# EAGLE design stm32f0_i2s (EAGLE 7.5.0)
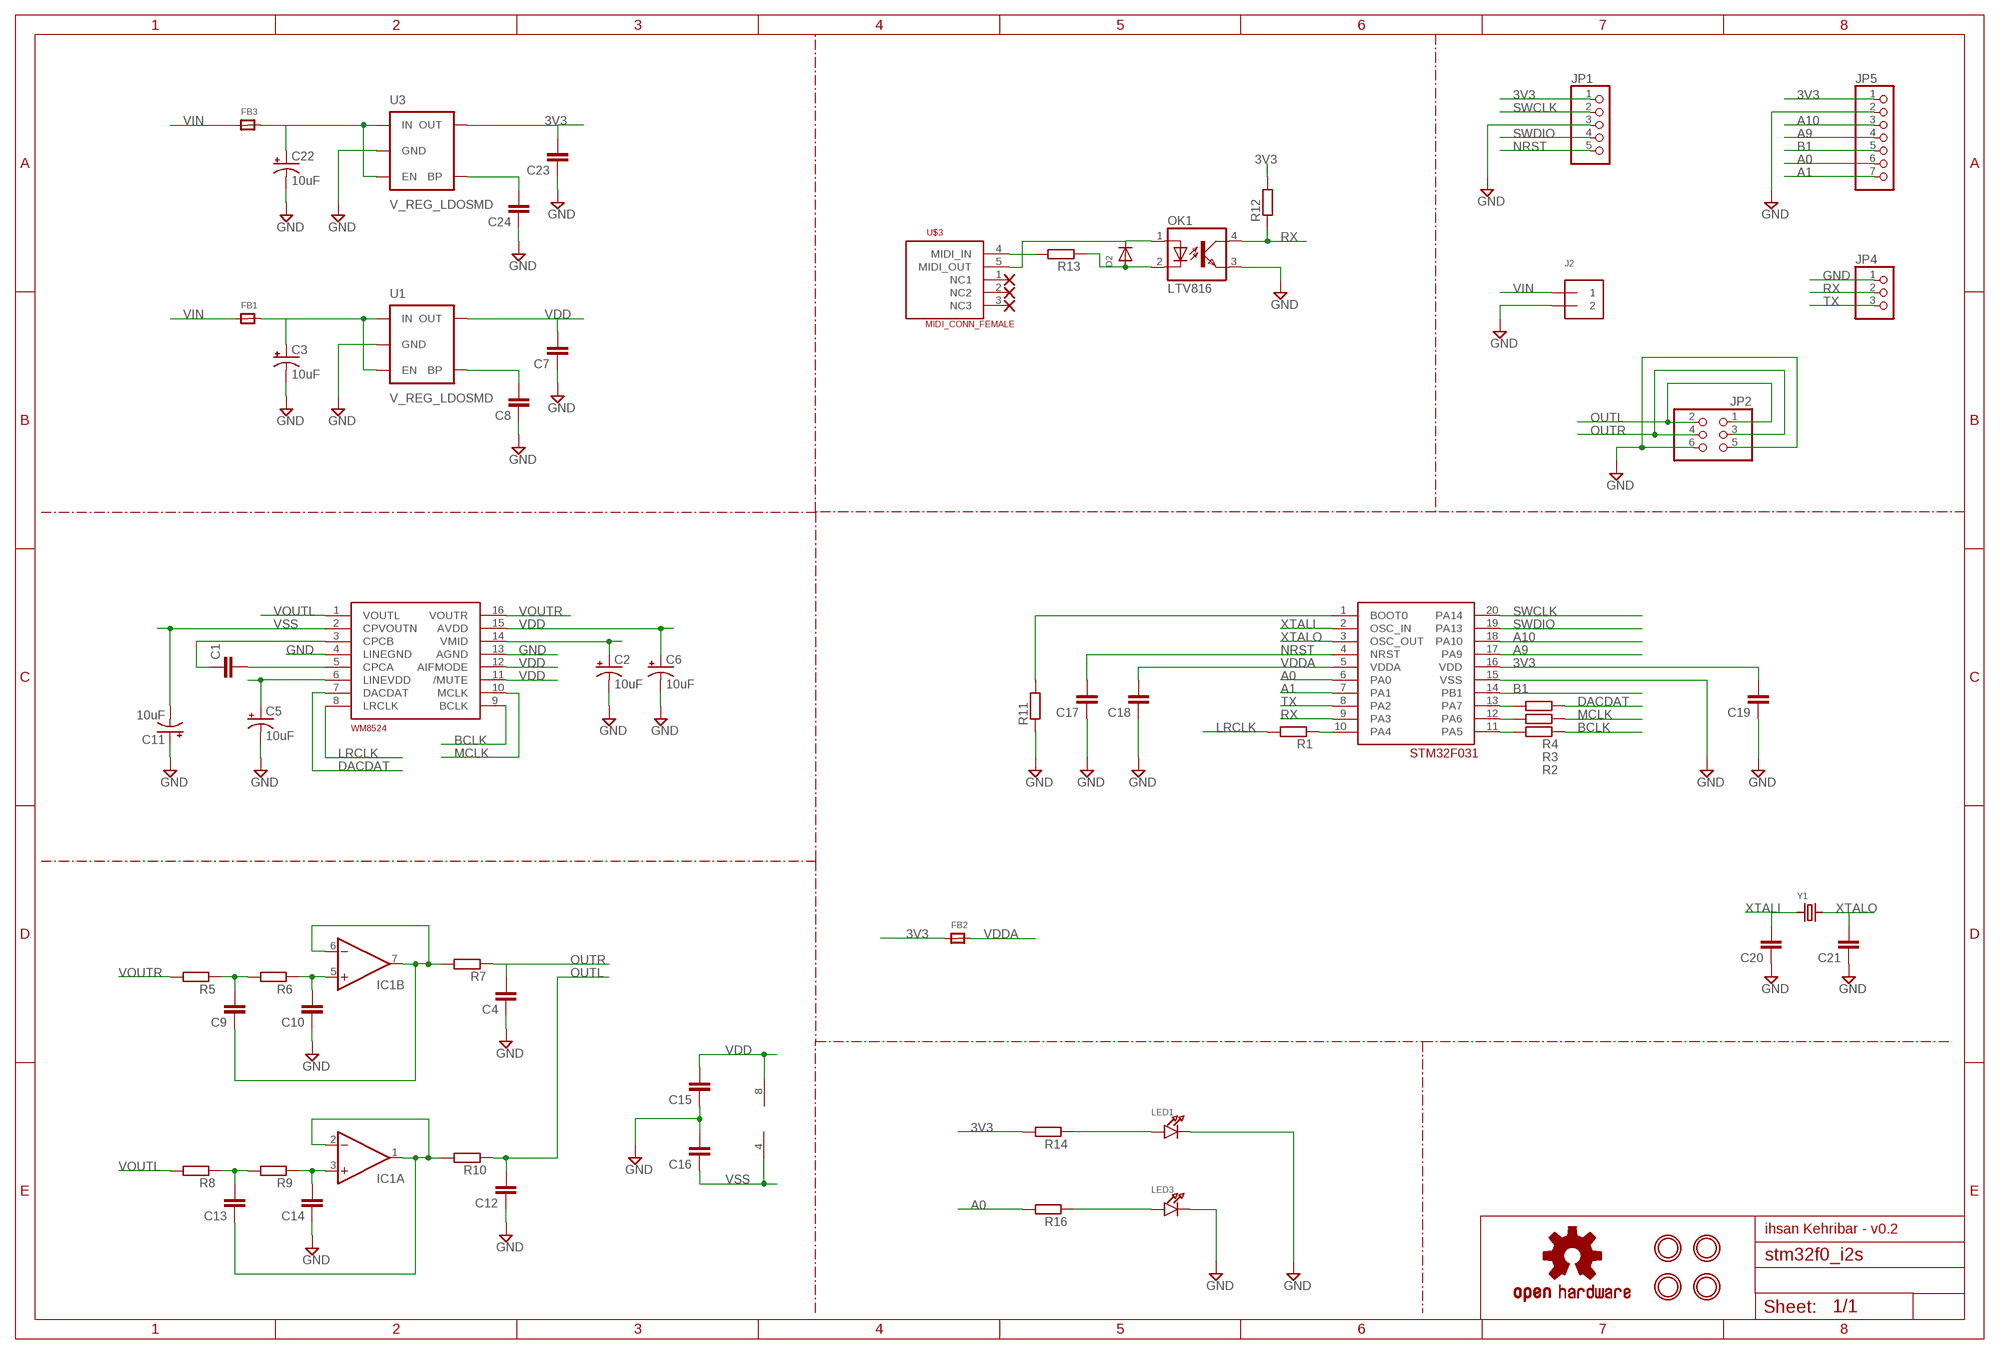
[diagram p0: schematic, sheet 1]

## Parts
C1  C-EUC0805  [C0805]
C2  10uF  10UF-TANT  [EIA3216]
C3  10uF  10UF-TANT  [EIA3216]
C4  C-EUC0805  [C0805]
C5  10uF  10UF-TANT  [EIA3216]
C6  10uF  10UF-TANT  [EIA3216]
C7  C-EUC0805  [C0805]
C8  C-EUC0805  [C0805]
C9  C-EUC0805  [C0805]
C10  C-EUC0805  [C0805]
C11  10uF  10UF-TANT  [EIA3216]
C12  C-EUC0805  [C0805]
C13  C-EUC0805  [C0805]
C14  C-EUC0805  [C0805]
C15  C-EUC0805  [C0805]
C16  C-EUC0805  [C0805]
C17  C-EUC0805  [C0805]
C18  C-EUC0805  [C0805]
C19  C-EUC0805  [C0805]
C20  C-EUC0805  [C0805]
C21  C-EUC0805  [C0805]
C22  10uF  10UF-TANT  [EIA3216]
C23  C-EUC0805  [C0805]
C24  C-EUC0805  [C0805]
D2  DIODEDO-1N4148  [DO-1N4148]
FB1  FERRITE0805  [0805]
FB2  FERRITE0805  [0805]
FB3  FERRITE0805  [0805]
IC1  TL082D  [SO08]
J2  TERMBLOCK_1X2  [TERMBLOCK_1X2-3.5MM]
JP1  HEADER-1X5ROUND  [1X05_ROUND]
JP2  PINHD-2X3  [2X03]
JP4  HEADER-1X3ROUND  [1X03_ROUND]
JP5  HEADER-1X7ROUND  [1X07_ROUND]
LED1  LED1206  [CHIPLED_1206]
LED3  LED1206  [CHIPLED_1206]
LOGO1  OSHW-LOGOM  [OSHW-LOGO-M]
OK1  LTV816  [DIL04]
R1  R-EU_R0805  [R0805]
R2  R-EU_R0805  [R0805]
R3  R-EU_R0805  [R0805]
R4  R-EU_R0805  [R0805]
R5  R-EU_R0805  [R0805]
R6  R-EU_R0805  [R0805]
R7  R-EU_R0805  [R0805]
R8  R-EU_R0805  [R0805]
R9  R-EU_R0805  [R0805]
R10  R-EU_R0805  [R0805]
R11  R-EU_R0805  [R0805]
R12  R-EU_R0805  [R0805]
R13  R-EU_R0805  [R0805]
R14  R-EU_R0805  [R0805]
R16  R-EU_R0805  [R0805]
U1  V_REG_LDOSMD  [SOT23-5]
U3  V_REG_LDOSMD  [SOT23-5]
U$1  IHSAN_WM8524  [TSSOP16]
U$2  IHSAN_STM32F031  [TSSOP20]
U$3  MIDI_CONN_FEMALE  [DIN_5_FEMALE]
U$4  MOUNTINGHOLE3.0THIN  [MOUNTINGHOLE_3.0_PLATEDTHIN]
U$5  MOUNTINGHOLE3.0THIN  [MOUNTINGHOLE_3.0_PLATEDTHIN]
U$6  MOUNTINGHOLE3.0THIN  [MOUNTINGHOLE_3.0_PLATEDTHIN]
U$7  MOUNTINGHOLE3.0THIN  [MOUNTINGHOLE_3.0_PLATEDTHIN]
Y1  CRYSTALTHIN32K  [CRYSTAL_4.9X1.8]

## Nets
3V3: C19.2 C23.2 FB2.1 JP1.1 JP5.1 R12.2 R14.2 U3.5(OUT) U$2.16(VDD)
A0: JP5.6 R16.2 U$2.6(PA0)
A1: JP5.7 U$2.7(PA1)
A9: JP5.4 U$2.17(PA9)
A10: JP5.3 U$2.18(PA10)
B1: JP5.5 U$2.14(PB1)
BCLK: R2.1 U$1.9(BCLK)
DACDAT: R4.1 U$1.7(DACDAT)
GND: C2.C(-) C3.C(-) C4.1 C5.C(-) C6.C(-) C7.1 C8.1 C10.1 C11.A(+) C12.1 C14.1 C15.1 C16.2 C17.1 C18.1 C19.1 C20.1 C21.1 C22.C(-) C23.1 C24.1 J2.2 JP1.3 JP2.5 JP2.6 JP4.1 JP5.2 LED1.C LED3.C OK1.3(EMIT) R11.1 U1.2(GND) U3.2(GND) U$1.4(LINEGND) U$1.13(AGND) U$2.15(VSS)
LRCLK: R1.2 U$1.8(LRCLK)
MCLK: R3.1 U$1.10(MCLK)
N$1: C1.1 U$1.3(CPCB)
N$2: C1.2 U$1.5(CPCA)
N$3: C2.A(+) U$1.14(VMID)
N$4: C5.A(+) U$1.6(LINEVDD)
N$5: C22.A(+) FB3.2 U3.1(IN) U3.3(EN)
N$6: R1.1 U$2.10(PA4)
N$7: R2.2 U$2.11(PA5)
N$8: R3.2 U$2.12(PA6)
N$9: R4.2 U$2.13(PA7)
N$10: C9.2 R5.1 R6.2
N$11: C10.2 IC1.5(B:+IN) R6.1
N$12: C3.A(+) FB1.2 U1.1(IN) U1.3(EN)
N$13: C8.2 U1.4(BP)
N$14: C9.1 IC1.6(B:-IN) IC1.7(B:OUT) R7.2
N$15: D2.C OK1.1(A) U$3.5(MIDI_OUT)
N$16: C13.2 R8.1 R9.2
N$17: C14.2 IC1.3(A:+IN) R9.1
N$18: C13.1 IC1.1(A:OUT) IC1.2(A:-IN) R10.2
N$19: D2.A OK1.2(C) R13.1
N$20: R11.2 U$2.1(BOOT0)
N$21: C24.2 U3.4(BP)
N$22: R13.2 U$3.4(MIDI_IN)
N$24: LED3.A R16.1
N$26: LED1.A R14.1
NRST: C17.2 JP1.5 U$2.4(NRST)
OUTL: C12.2 JP2.1 JP2.2 R10.1
OUTR: C4.2 JP2.3 JP2.4 R7.1
RX: JP4.2 OK1.4(COL) R12.1 U$2.9(PA3)
SWCLK: JP1.2 U$2.20(PA14)
SWDIO: JP1.4 U$2.19(PA13)
TX: JP4.3 U$2.8(PA2)
VDD: C6.A(+) C7.2 C15.2 IC1.8(P:V+) U1.5(OUT) U$1.11(/MUTE) U$1.12(AIFMODE) U$1.15(AVDD)
VDDA: C18.2 FB2.2 U$2.5(VDDA)
VIN: FB1.1 FB3.1 J2.1
VOUTL: R8.2 U$1.1(VOUTL)
VOUTR: R5.2 U$1.16(VOUTR)
VSS: C11.C(-) C16.1 IC1.4(P:V-) U$1.2(CPVOUTN)
XTALI: C20.2 U$2.2(OSC_IN) Y1.1
XTALO: C21.2 U$2.3(OSC_OUT) Y1.2
Unconnected: U$3.1(NC1) U$3.2(NC2) U$3.3(NC3)

## Notes on the sheet
- ihsan Kehribar - v0.2

## Library data of the parts
C1 C4 C7-C10 C12-C21 C23 C24 = rcl:C-EU: CAPACITOR, European symbol
C2 C3 C5 C6 C11 C22 = SparkFun-Capacitors:10UF-TANT: 10uF Tantalum SMT CAP-00811- 16V 10% (EIA-3216); PROD_ID: CAP-00811
D2 = microbuilder:DIODE: Diode SMA Model Volts Amps Type Vf Vr Digikey # Notes SSA34-E3 40V 3A Schottky 480mV @ 3A 200uA @ 40V SSA34-E3/61TGITR-ND CDBA120-G 20V 1A Schottky 500mV @ 1A 500uA @ 20V 641-1014-6-ND REEL MBRA210 10V 2A Schottky 350mV @ 2A 700uA @ 10V MBRA210LT3 SOD-123 Model Volts Amps Type Vf Vr Order # Notes BAT54T1G 30V 200mA Schottky 800mV @ 200mA 2uA @ 25V BAT54T1GOSTR-ND B0530W 30V 500mA Schottky 430mV @ 500mA 130uA @ 30V B0530W-FDICT-ND REEL MBR120 1A 20V Schottky 340mV @ 1A MBR120VLSFT1GOSCT-ND SOD-323 Model Volts Amps Type Vf Vr Order # Notes PMEG2005EJ 20V 500mA Schottky 355mV @ 500mA 568-4110-1-ND ZLLS410 10V 570mA Schottky 380mV @ 570mA ZLLS410CT-ND 1N4148WS 75V 150mA Silicon/Simple 1V 1N4148WSFSCT-ND REEL SOD-523 Model Volts Amps Type Vf Vr Order # Notes BAT54XV2 30V 200mA Schottky 0.8V @ 100mA BAT54XV2CT-ND TB751S 30V 30mA Schottky RB751S-40TE61CT-ND SOT23-R/W (R = Solder Paste/Reflow Ovens, W = Hand-Soldering) Model Volts Amps Type Vf Vr Order # Notes BAT54FILM 40V 300mA Schottky 497-7162-1-ND
FB1-FB3 = microbuilder:FERRITE: Ferrite Bead 0603 MMZ1608B121C - 120 Ohm @ 100MHz, 600mA, 0.15 Ohm DC Resistance - Digikey: 445-2164-1-ND BK1608HW121-T - 120 Ohm, 600mA Ferrite Chip - Digikey: 587-1876-2-ND 0805 HZ0805B272R-10 - 2.7K Ohm @ 100MHz, 200mA, 0.8 Ohm DC Resistance - Digikey: 240-2504-1-ND (see also Murata BLM21BD272SN1L) MMZ2012Y152B - 1.5K Ohm @ 100MHz, 500mA, 0.4 Ohm DC Resistance - Digikey: 445-1560-1-ND - Mainly for high frequency (80-400MHz) MMZ2012R102A - 1K Ohm @ 100MHz, 500mA, 0.3 Ohm DC Resistance - Digikey: 445-1555-2-ND - More general purpose (10-200MHz)
IC1 = linear:TL082: OP AMP Data sheet <http://www.ti.com/lit/ds/symlink/tl084a . pdf>; DATA_SHEET: <a href="http://www.ti.com/lit/ds/symlink/tl084a.pdf"> Data sheet </a>
J2 = microbuilder:TERMBLOCK_1X2: 3.5mm Terminal block http://www.ladyada.net/library/pcb/eaglelibrary.html
JP1 = microbuilder:HEADER-1X5: PIN HEADER
JP2 = pinhead:PINHD-2X3: PIN HEADER
JP4 = microbuilder:HEADER-1X3: PIN HEADER
JP5 = microbuilder:HEADER-1X7: PIN HEADER
LED1 LED3 = microbuilder:LED: LED 0603 - 0603 Surface Mount Package 2mA: Green LED - Low Power (3.9mcd, 2ma, 1.7Vf) - Digikey: 475-2709-2-ND Orange LED - Low Power (9.8mcd, 2ma, 1.8Vf) - Digikey: 475-1194-2-ND Red LED - Low Power (5mcd, 2ma, 1.8Vf) - Digikey: 475-1195-2-ND Yellow LED - Low Power (7mcd, 2ma, 1.8Vf) - Digikey: 475-1196-2-ND 5mA: Blue LED - Low Power (17mcd, 5ma, 2.9Vf) - Digikey: LNJ937W8CRACT-ND 0805 - 0805 Surface Mount Package 2mA: Red LED (8.8mcd, 2mA, 1.8Vf, Clear) - Low Power [Digikey: 475-2510-1-ND] Green LED (5mcd, 2mA, 1.8Vf, Clear) - Low Power [Digikey: 475-2730-1-ND] Yellow LED (11.3mcd, 2mA, 1.8Vf, Clear) - Low Power [Digikey: 475-2555-1-ND] 20mA: Red LED (104mcd, 20mA, Diffused) - LS R976 [Digikey: 475-1278-6-ND] Red LED (12mcd, 20mA, 2.0Vf, Clear) - APT2012EC [Digikey: 754-1128-1-ND] Green LED (15mcd, 20mA, 2.2Vf, Clear) - APT2012GC [Digikey: 754-1131-1-ND] Orange LED (160mcd, 20mA, 2.1Vf, Clear) - APT2012SECK [Digikey: 754-1130-1-ND] 1206 - 1206 Surface Mount Package Green LED (26mcd, 20mA, Diffused) - LG N971 [Digikey: 475-1407-6-ND] Red LED (15mcd, 20mA, Diffused) - LH N974 [Digikey: 475-1416-6-ND]
LOGO1 = SparkFun-Aesthetics:OSHW-LOGO: Open Source Hardware Logo This logo indicates the piece of hardware it is found on incorporates a OSHW license and/or adheres to the definition of open source hardware found here: http://freedomdefined.org/OSHW
OK1 = optocoupler:LTV816: OPTO COUPLER Source: LITEON, LTV816.pdf; OC_FARNELL: unknown; OC_NEWARK: unknown
R1-R14 R16 = rcl:R-EU_: RESISTOR, European symbol
U1 U3 = SparkFun-PowerIC:V_REG_LDO: Voltage Regulator LDO Standard 150mA LDO voltage regulator in SOT-23 layout. Micrel part MIC5205. BP (by-pass) pin is used to lower output noise with 470pF cap.
U$1 = SparkFun-DigitalIC_ihsan:IHSAN_WM8524
U$2 = SparkFun-DigitalIC_ihsan:IHSAN_STM32F031
U$3 = SparkFun-Connectors:MIDI_CONN_FEMALE: MIDI connector, no strain relieve (DIN-5 female)
U$4-U$7 = microbuilder:MOUNTINGHOLE: Mounting Hole For #2 screws (0.086"/2.18mm width, 0.094"/2.4mm hole) use 2.5mm
Y1 = microbuilder:CRYSTAL: Crystals HC49UP - Surface Mount Crystal 4.0MHz 18pF +/-30ppm Surface Mount Crystal [Digikey: 535-9857-1-ND] 12.0 MHz Surface Mount Crystal [Digikey: 535-9869-6-ND] 25.0 MHz Surface Mount Crystal [Digikey: 535-9078-1-ND] 2.5 x 2.0mm - MEMs SMT Crystal 16.0 MHz 10pF 20ppm 2.5 x 2.0mm Crystal [Digikey -40-85°C: 535-10923-1-ND] 3.2 x 2.5mm - MEMs SMT Crystal 12.0 MHz 8pF 15ppm 3.2 x 2.5mm Crystal [Digikey: -10-70°C: 644-1047-1-ND -40-125°C: 644-1128-1-ND] 16.0 MHz 8pF 15ppm 3.2 x 2.5mm Crystal [Digikey: -10-70°C: 644-1049-1-ND -40-125°C: 644-1129-2-ND] 16.0 MHz 10pF 10ppm 3.2 x 2.5mm Crystal [Digikey: 644-1100-1-ND] 27.12 MHz 18pF 30ppm 3.2 x 2.5mm Crystal [Digikey: 887-1424-1-ND] 27.12MHz 10pF 10ppm 3.2 x 2.5mm Crystal [Digikey: 887-1329-1-ND] 4.9 x 1.8mm - MEMs SMT Crystal 32.768 KHz 12.5pF 20ppm 4.9 x 1.8mm Crystal [Digikey: SE2415CT-ND] 8.0 x 3.8mm - Surface Mount Crystal 32.768kHz 12.5pF 20ppm -40°C-85°C [Digikey: 535-9166-2-ND] Cylinder 32.768KHz Cylinder Crystal (2x6mm body) [Ex. Digikey: 300-8341-2-ND]

## Board
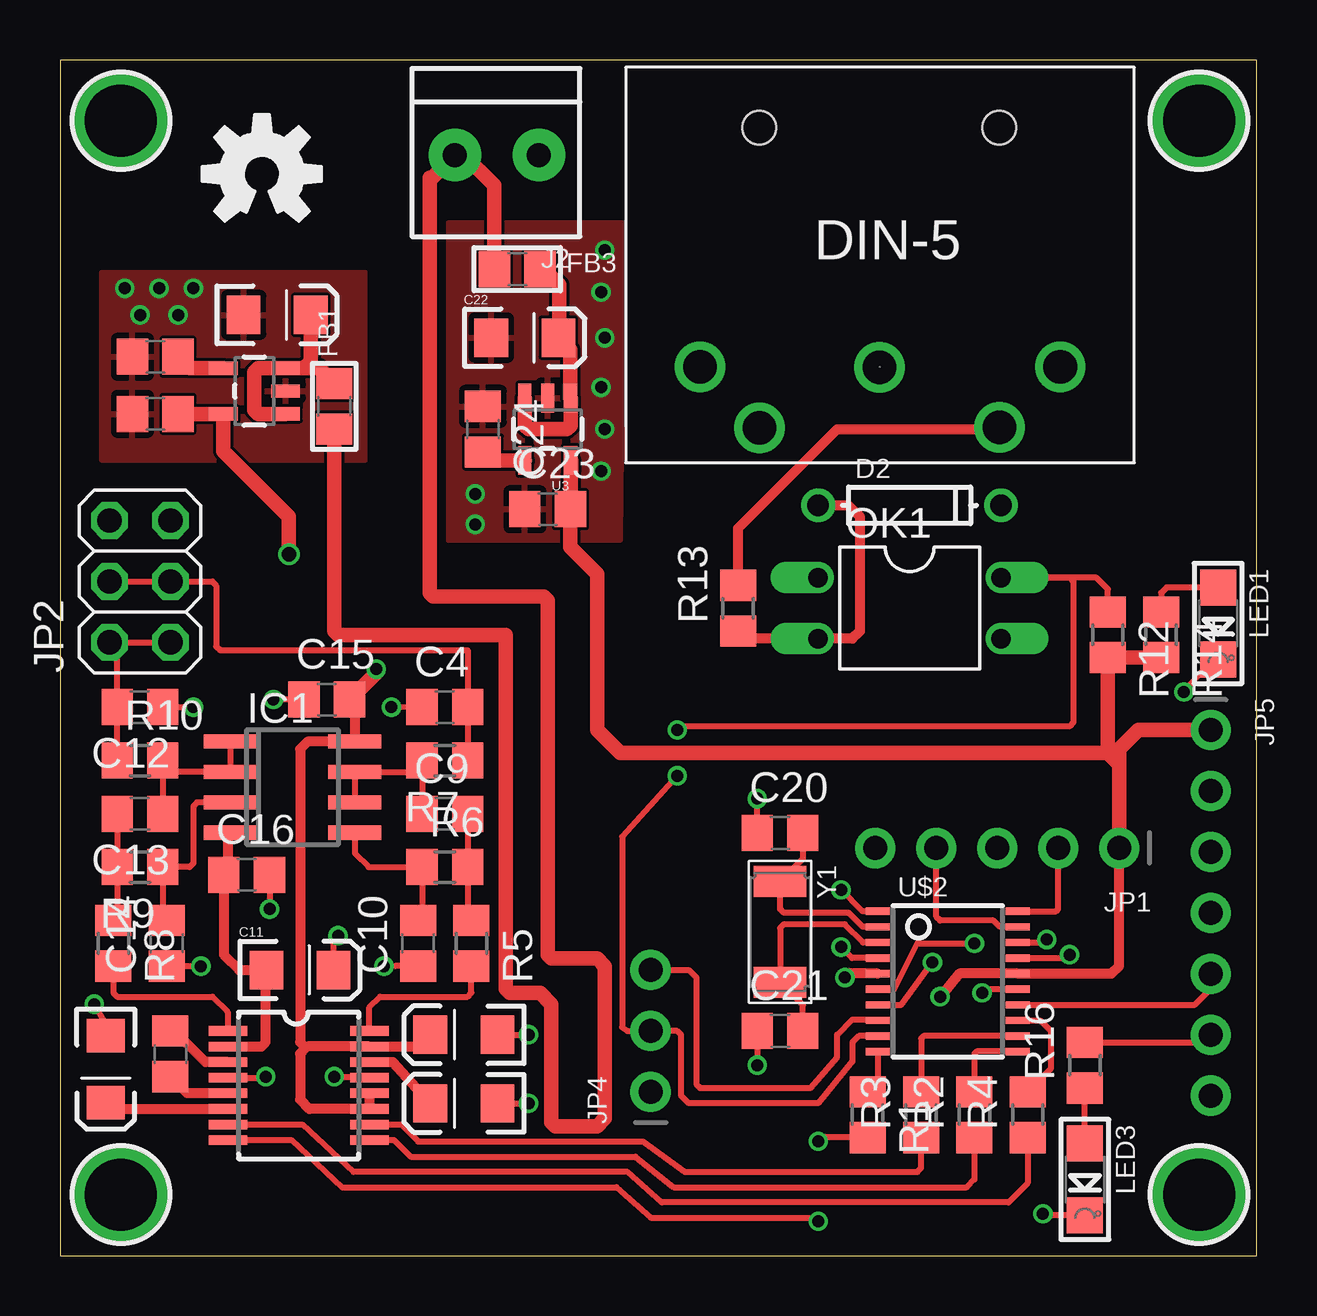
[diagram p1: board, top side]
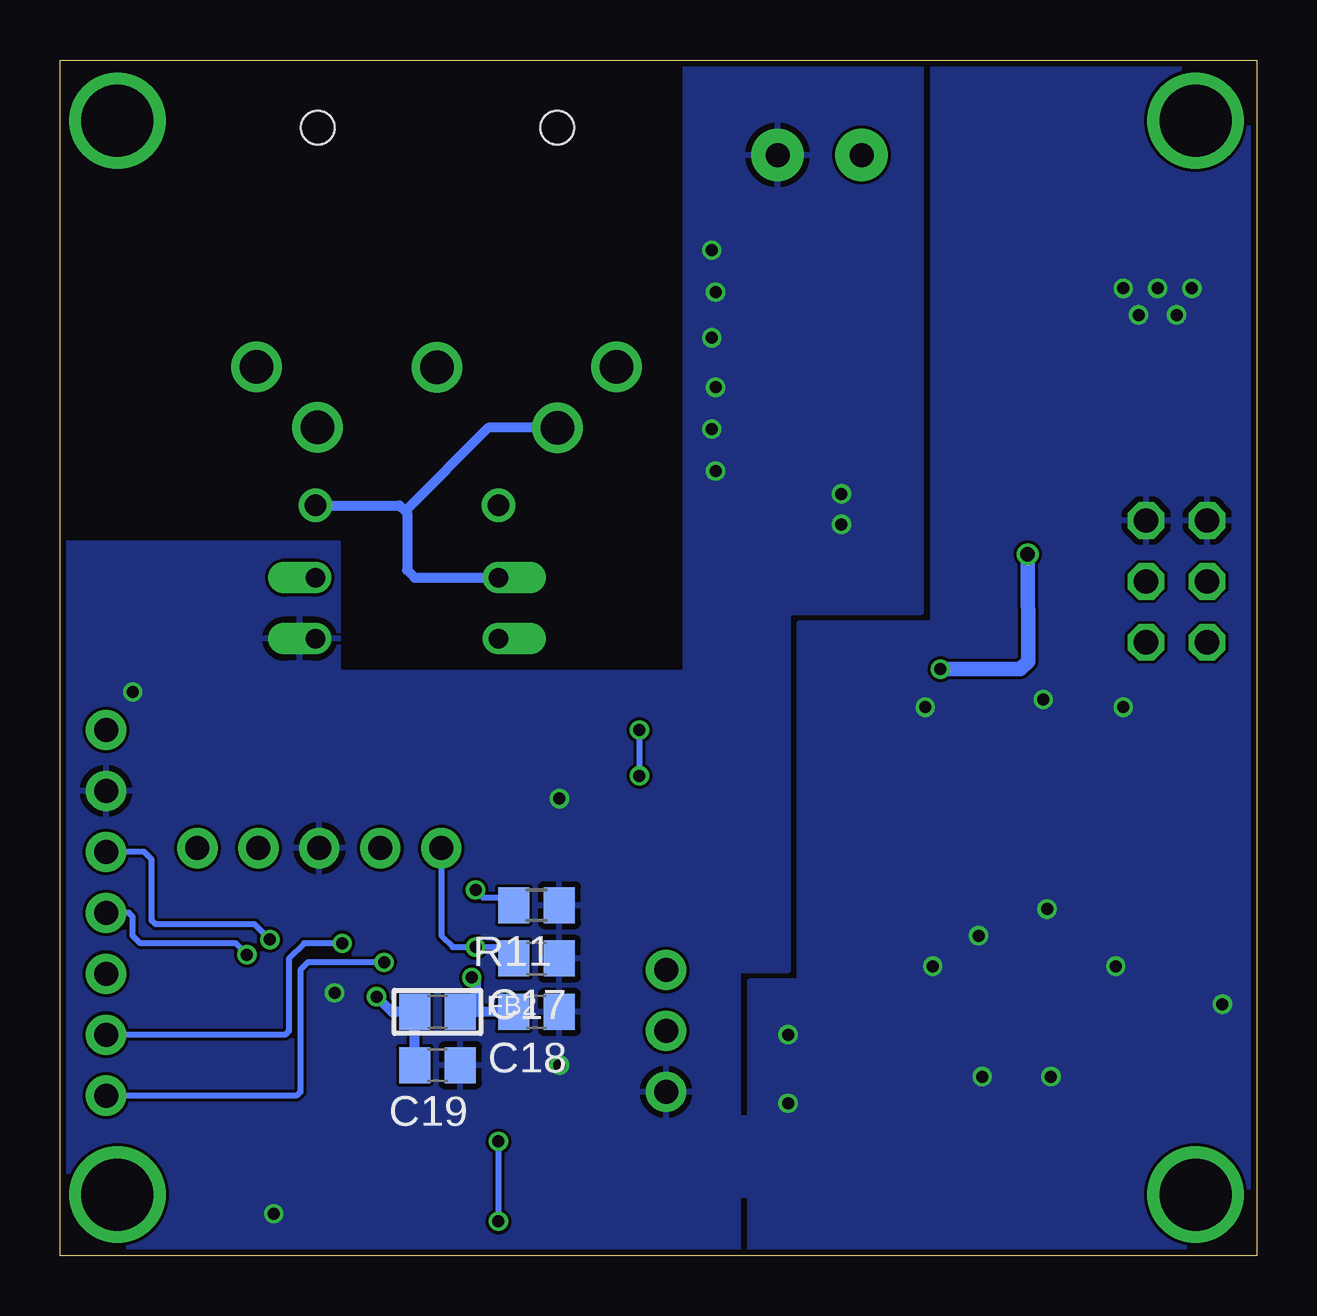
[diagram p2: board, bottom side, seen from below]

Size 49.86 x 49.84 mm. Coordinates in mm from the lower left corner, seen from the top.
Outline: 0,0 49.86,0 49.86,49.84 0,49.84 0,0
Copper layers (1*16): Top 0.035mm / dielectric 1.5mm / Bottom 0.035mm
Design rules "dirt_cheap_dirty_boards.v1": minimum track width 5mil, minimum drill 12mil, track to track 5mil, track to pad 5mil, pad to pad 5mil, via to via 5mil, smd to smd 0mil, copper to edge 10mil, drill to drill 10mil, minimum pad ring 10mil, minimum via ring 6mil, stop-mask expansion 2mil, vias tented up to drill 25mil, thermal gap 10mil

### Footprints (pad centres in the part's own frame; a part is rotated, then mirrored left to right if it is on the bottom)
C0805 = smd 1.3 x 1.5: 1 -0.95,0; 2 0.95,0
EIA3216 = smd 1.4 x 1.6: A 1.4,0; C -1.4,0
DO-1N4148 = drill 0.9: A -3.81,0; C 3.81,0
0805 = smd 1.3 x 1.5: 1 -0.95,0; 2 0.95,0
SO08 = smd 0.6 x 2.2: 1 -1.905,-2.6; 2 -0.635,-2.6; 3 0.635,-2.6; 4 1.905,-2.6; 5 1.905,2.6; 6 0.635,2.6; 7 -0.635,2.6; 8 -1.905,2.6
TERMBLOCK_1X2-3.5MM = drill 1 pad 2.184: 1 1.8,0; 2 -1.7,0
1X05_ROUND = drill 1 pad 1.676: 1 -5.08,0; 2 -2.54,0; 3 0,0; 4 2.54,0; 5 5.08,0
2X03 = drill 1.016 octagon: 1 -2.54,-1.27; 2 -2.54,1.27; 3 0,-1.27; 4 0,1.27; 5 2.54,-1.27; 6 2.54,1.27
1X03_ROUND = drill 1 pad 1.676: 1 -2.54,0; 2 0,0; 3 2.54,0
1X07_ROUND = drill 1 pad 1.676: 1 -7.62,0; 2 -5.08,0; 3 -2.54,0; 4 0,0; 5 2.54,0; 6 5.08,0; 7 7.62,0
CHIPLED_1206 = smd 1.5 x 1.5: A 0,-1.496; C 0,1.496
DIL04 = drill 0.813 offset: 1 -1.27,-3.81; 2 1.27,-3.81; 3 1.27,3.81; 4 -1.27,3.81
R0805 = smd 1.3 x 1.5: 1 -0.95,0; 2 0.95,0
SOT23-5 = smd 0.55 x 1.2: 1 -0.95,-1.3; 2 0,-1.3; 3 0.95,-1.3; 4 0.95,1.3; 5 -0.95,1.3
TSSOP16 = smd 0.4 x 1.6: 1 -2.225,-2.85; 2 -1.575,-2.85; 3 -0.925,-2.85; 4 -0.275,-2.85; 5 0.375,-2.85; 6 1.025,-2.85; 7 1.675,-2.85; 8 2.325,-2.85; 9 2.325,3.05; 10 1.675,3.05; 11 1.025,3.05; 12 0.375,3.05; 13 -0.275,3.05; 14 -0.925,3.05; 15 -1.575,3.05; 16 -2.225,3.05
TSSOP20 = smd 0.305 x 0.991: 1 -2.925,-2.918; 2 -2.275,-2.918; 3 -1.625,-2.918; 4 -0.975,-2.918; 5 -0.325,-2.918; 6 0.325,-2.918; 7 0.975,-2.918; 8 1.625,-2.918; 9 2.275,-2.918; 10 2.925,-2.918; 11 2.925,2.918; 12 2.275,2.918; 13 1.625,2.918; 14 0.975,2.918; 15 0.325,2.918; 16 -0.325,2.918; 17 -0.975,2.918; 18 -1.625,2.918; 19 -2.275,2.918; 20 -2.925,2.918
DIN_5_FEMALE = drill 1.4: 1 0.46,3.61; 2 -7.07,3.6; 3 7.94,3.6; 4 -4.53,6.12; 5 5.47,6.13 | hole 1.4: -4.52,-6.38; 5.47,-6.38
MOUNTINGHOLE_3.0_PLATEDTHIN = drill 3 pad 3.6: P$1 0,0
CRYSTAL_4.9X1.8 = smd 1.3 x 2.2: 1 -2.1,0; 2 2.1,0

### Placement (x,y rotation side)
C1  4.6,8.41 270 top
C2  16.83,6.35 180 top
C3  9.05,39.21 0 top
C4  16.03,22.86 0 top
C5  1.91,7.78 270 top
C6  16.83,9.21 180 top
C7  3.97,35.08 0 top
C8  3.97,37.47 0 top
C9  16.03,18.41 0 top
C10  14.92,13.02 90 top
C11  10,11.91 0 top
C12  3.33,22.86 180 top
C13  3.33,18.41 180 top
C14  4.45,13.02 90 top
C15  11.11,23.18 0 top
C16  7.78,15.88 0 top
C17  30,12.38 180 bottom
C18  30,10.16 180 bottom
C19  34.13,7.94 180 bottom
C20  30,17.62 0 top
C21  30,9.37 0 top
C22  19.37,38.26 0 top
C23  20.32,31.11 0 top
C24  17.62,34.45 270 top
D2  35.4,31.27 0 top
FB1  11.43,35.4 90 top
FB2  34.13,10.16 0 bottom
FB3  19.05,41.12 0 top
IC1  9.68,19.53 270 top
J2  18.26,45.88 180 top
JP1  39.05,16.99 180 top
JP2  3.33,28.1 90 top
JP4  24.61,9.37 90 top
JP5  47.94,14.29 270 top
LED1  48.26,26.35 180 top
LED3  42.7,3.17 180 top
LOGO1  8.41,45.09 0 top
OK1  35.4,26.99 270 top
R1  33.66,5.87 270 top
R2  38.1,5.87 90 top
R3  35.88,5.87 90 top
R4  40.32,5.87 90 top
R5  17.14,13.02 270 top
R6  16.03,16.19 0 top
R7  16.03,20.64 180 top
R8  2.22,13.02 270 top
R9  3.33,16.19 180 top
R10  3.33,20.64 0 top
R11  30,14.61 180 bottom
R12  43.66,25.88 270 top
R13  28.26,26.99 90 top
R14  45.88,25.88 270 top
R16  42.7,7.94 90 top
U1  8.1,36.04 90 top
U3  20.32,34.45 180 top
U$1  9.84,7.14 270 top
U$2  36.99,11.43 270 top
U$3  34.61,40.64 180 top
U$4  47.47,2.54 0 top
U$5  47.47,47.31 0 top
U$6  2.54,47.31 0 top
U$7  2.54,2.54 0 top
Y1  30,13.49 270 top

### Tracks (layer width: path | path; a pad name or v marks a point on that pad's centre or on a via)
3V3  (via drill 0.5)
  Top 0.254: U3.5 21.3,33.15
  Top 0.406: v36.67,10.79 37.47,11.76 U$2.16 43.82,11.76 44.13,12.06 JP1.1
  Top 0.61: 21.3,33.15 C23.2 21.27,29.53 22.38,28.42 22.38,21.91 23.34,20.95 43.66,20.95 44.13,20.48 | 44.13,21.11 43.97,20.95 43.66,21.27 R12.2 R14.2 | 44.13,21.11 44.13,20.48 | 44.13,20.48 JP1.1 | JP5.1 44.93,21.91 44.13,21.11
  Bottom 0.406: C19.2 FB2.1 36.04,10.16 v36.67,10.79
A0  (via drill 0.5)
  Top 0.254: U$2.6 34.76,11.11 35.72,13.02 v38.1,13.02 | R16.2 47.62,8.89 JP5.6
  Bottom 0.254: v38.1,13.02 39.69,13.02 40.32,12.38 40.32,9.37 40.48,9.21 JP5.6
A1  (via drill 0.5)
  Top 0.254: U$2.7 35.06,10.46 v36.35,12.22
  Bottom 0.254: v36.35,12.22 39.53,12.22 39.85,11.91 39.85,6.83 40.01,6.67 JP5.7
A9  (via drill 0.5)
  Top 0.254: U$2.17 41.93,12.4 v42.07,12.54
  Bottom 0.254: v42.07,12.54 42.55,13.02 46.51,13.02 46.83,13.34 46.83,14.13 46.99,14.29 JP5.4
A10  (via drill 0.5)
  Top 0.254: U$2.18 40.99,13.05 v41.12,13.18
  Bottom 0.254: v41.12,13.18 41.75,13.81 45.88,13.81 46.04,13.97 46.04,16.51 46.35,16.83 JP5.3
B1
  Top 0.254: U$2.14 47.28,10.46 47.94,11.11 JP5.5
BCLK
  Top 0.254: R2.1 38.1,3.17 37.78,2.86 25.56,2.86 23.97,4.13 14.61,4.13 13.91,4.82 U$1.9
DACDAT
  Top 0.254: R4.1 40.32,3.02 39.53,2.22 25.08,2.22 23.65,3.49 12.22,3.49 10.09,5.47 U$1.7
GND  (via drill 0.5)
  Top 0.254: C15.1 v8.89,23.18 | C4.1 13.97,22.86 v13.81,22.86 | C16.2 v8.73,14.45 | C10.1 13.97,12.07 v13.49,12.06 | U$1.4 8.53,7.42 v8.57,7.46 | v11.43,7.46 12.85,7.46 U$1.13 | C5.C 1.91,9.68 v1.43,10.48 | C14.1 5.71,12.07 v5.87,12.06 | C11.A 11.4,13.15 v11.59,13.34 | C12.1 v5.56,22.86 | C2.C v19.53,6.35 | C6.C v19.53,9.21 | U$2.15 38.57,11.11 v38.42,10.95 | C21.1 v29.05,7.94 | C20.1 v29.05,19.05 | LED1.C 48.03,24.86 v46.83,23.5 | LED3.C 41.02,1.68 v40.96,1.75
  other vias: 22.54,36.2 22.7,34.45 22.54,40.16 22.7,41.91 17.3,31.75 22.7,38.26 17.3,30.48 22.54,32.7 4.13,40.32 5.56,40.32 2.7,40.32 3.33,39.21 4.92,39.21
  pour Top: 16.19,43.02 16.19,29.84 23.34,29.84 23.5,43.02
  pour Bottom: 0,0 0,49.85 13.49,49.85 13.49,26.35 19.05,26.35 19.05,11.43 21.11,11.43 21.11,5.71 21.59,5.71 21.59,11.91 19.53,11.91 19.53,26.83 13.97,26.83 13.97,49.85 23.81,49.85 23.81,24.29 38.26,24.29 38.26,29.69 49.85,29.69 49.85,0 21.59,0 21.59,2.54 21.11,2.54 21.11,0
  pour Top: 1.75,40.96 1.75,33.18 12.7,33.18 12.7,40.96
LRCLK  (via drill 0.5)
  Top 0.254: v31.59,1.43 31.43,1.59 24.61,1.59 23.18,2.86 11.75,2.86 9.63,4.82 U$1.8 | R1.2 31.75,4.92 v31.59,4.76
  Bottom 0.254: v31.59,4.76 v31.59,1.43
MCLK
  Top 0.254: R3.1 35.88,3.65 35.72,3.49 26.04,3.49 24.29,4.76 14.92,4.76 14.22,5.47 U$1.10
N$1
  Top 0.406: C1.1 4.76,9.36 6.06,8.07 U$1.3
N$2
  Top 0.254: C1.2 4.76,7.46
  Top 0.406: U$1.5 5.3,6.77 C1.2
N$3
  Top 0.406: U$1.14 13.87,8.07 C2.A
N$4
  Top 0.254: 2.17,6.12 C5.A
  Top 0.406: 2.17,6.12 U$1.6
N$5
  Top 0.254: U3.1 | FB3.2 20.16,41.12 | 20.8,38.29 C22.A
  Top 0.61: U3.3 19.37,34.6 19.53,34.45 21.11,34.45 21.27,34.61 U3.1 | U3.1 21.27,37.76 C22.A | 20.16,41.12 20.8,40.48 20.8,38.29
N$6
  Top 0.254: U$2.10 34.07,7.24 R1.1
N$7
  Top 0.254: U$2.11 38.19,8.51 38.1,8.41 R2.2
N$8
  Top 0.254: U$2.12 35.98,9.15 35.88,9.05 R3.2
N$9
  Top 0.254: U$2.13 40.84,9.8 41.27,9.37 41.27,7.78 R4.2
N$10
  Top 0.254: C9.2 R6.2 16.98,14.13 R5.1 17.14,14.13
N$11
  Top 0.254: C10.2 15.08,14.13 R6.1 12.86,16.19 12.28,16.77 IC1.5
N$12
  Top 0.406: U1.1
  Top 0.61: U1.1 8.26,35.08 8.1,35.24 8.1,36.83 8.25,36.99 U1.3 10.16,36.99 | 10.16,36.99 10.79,36.99 FB1.2 | C3.A 10.45,37.27 10.16,36.99
N$13
  Top 0.406: 5.4,36.99 C8.2
  Top 0.61: U1.4 5.4,36.99
N$14
  Top 0.254: IC1.6 IC1.7 14.61,20.16 R7.2 C9.1
N$15
  Bottom 0.406: D2.C 35.72,31.27 35.48,31.04 | 35.48,31.04 35.4,30.96 35.4,28.57 35.08,28.26 OK1.1 | U$3.5 32.01,34.51 35.48,31.04
N$16
  Top 0.254: C13.2 R9.2 2.38,14.13 R8.1
N$17
  Top 0.254: IC1.3 5.71,18.89 5.56,18.73 5.56,16.35 5.4,16.19 R9.1 4.28,14.13 C14.2
N$18
  Top 0.254: IC1.1 IC1.2 4.76,20.16 R10.2 C13.1 4.6,18.1
N$19
  Top 0.406: R13.1 28.58,25.72 OK1.2 33.02,25.72 33.34,26.04 33.34,30.8 32.86,31.27 D2.A
N$20  (via drill 0.5)
  Top 0.254: v32.54,15.24 33.43,14.36 U$2.1
  Bottom 0.254: v32.54,15.24 32.23,14.92 31.27,14.92 R11.2
N$21
  Top 0.254: 17.97,33.15 C24.2
  Top 0.61: U3.4 17.97,33.15
N$22
  Top 0.406: R13.2 28.26,30.32 32.38,34.45 39.07,34.45 U$3.4
N$24
  Top 0.254: LED3.A R16.1
N$26
  Top 0.254: LED1.A 46.1,27.85 45.88,27.62 R14.1
NRST  (via drill 0.5)
  Top 0.254: v32.54,12.86 33,12.4 U$2.4
  Bottom 0.254: C17.2 31.11,12.7 31.27,12.86 v32.54,12.86 33.5,12.86 33.97,13.34 JP1.5
OUTL
  Top 0.254: JP2.1 JP2.2 2.38,25.24 C12.2 R10.1
OUTR
  Top 0.254: JP2.4 JP2.3 6.35,28.1 6.51,27.94 6.51,25.4 6.67,25.24 16.99,25.24 C4.2 R7.1
RX  (via drill 0.5)
  Top 0.254: R12.1 43.66,27.78 43.18,28.26 OK1.4 42.07,28.26 42.23,28.1 42.23,22.23 42.07,22.07 25.88,22.07 v25.72,21.91 | U$2.9 33.28,9.15 33.02,8.89 33.02,8.1 31.59,6.35 26.19,6.35 25.88,6.67 25.88,9.21 25.72,9.37 JP4.2 23.65,9.37 23.42,9.53 23.42,17.46 v25.72,20
  Bottom 0.254: v25.72,21.91 v25.72,20
SWCLK
  Top 0.254: U$2.20 41.5,14.36 41.59,14.45 JP1.2
SWDIO
  Top 0.254: U$2.19 39.16,13.71 38.89,13.97 36.67,13.97 36.51,14.13 JP1.4
TX
  Top 0.254: JP4.3 26.19,11.91 26.51,11.59 26.51,7.14 26.67,6.99 31.27,6.99 32.38,8.26 32.38,9.21 33.02,9.84 34.03,9.84 U$2.8
VDD  (via drill 0.5, 0.6)
  Top 0.254: 12.28,23.11 C15.2
  Top 0.406: 12.28,23.11 IC1.8 10.32,21.43 10,21.11 10,8.89 10.24,8.65 | U$1.12 U$1.11 10.39,6.12 10,6.51 10,8.41 10.24,8.65 | 10.24,8.65 10.31,8.72 U$1.15 14.94,8.72 C6.A 15.43,9.08 15.08,8.73 14.76,8.73 | C7.2
  Top 0.61: C7.2 U1.5 6.8,33.53 9.53,30.8 v9.54,29.24 | v13.18,24.45 13.18,24.29 C15.2
  Bottom 0.61: v9.54,29.24 9.53,24.77 9.84,24.45 v13.18,24.45
VDDA  (via drill 0.5)
  Top 0.406: U$2.5 32.87,11.76 v32.7,11.59
  Bottom 0.406: C18.2 32.54,10.16 | 32.54,10.16 FB2.2 | v32.7,11.59 32.54,11.43 32.54,10.16
VIN
  Top 0.254: FB3.1
  Top 0.61: FB3.1 18.1,44.61 16.83,45.88 J2.1 15.5,44.93 15.4,44.93 15.4,27.62 15.56,27.46 20.16,27.46 20.32,27.3 20.32,12.54 20.48,12.38 22.38,12.38 22.7,12.06 22.7,5.71 22.38,5.4 20.64,5.4 20.48,5.56 20.48,10.48 20,10.95 18.73,10.95 18.57,11.11 18.57,25.88 11.59,25.88 11.43,26.04 FB1.1
VOUTL
  Top 0.254: R8.2 2.22,10.95 2.38,10.79 6.35,10.79 6.99,10.16 U$1.1
VOUTR
  Top 0.254: U$1.16 12.89,10.35 13.34,10.79 16.99,10.79 17.14,10.95 R5.2
VSS
  Top 0.254: IC1.4 6.99,17.62 | 6.99,16.04 C16.1
  Top 0.406: U$1.2 8.4,8.72 8.57,8.89 8.57,11.88 C11.C 7.46,11.91 6.83,12.54 C16.1 6.99,16.03 6.99,17.62
XTALI
  Top 0.254: 30.52,15.4 Y1.1 | U$2.2 33.44,13.71 32.86,14.29 30.16,14.29 30,14.45 Y1.1 | C20.2 30.95,16.54 Y1.1
XTALO
  Top 0.254: U$2.3 33.46,13.05 32.7,13.81 30.16,13.81 30,13.65 Y1.2 30.95,10.44 C21.2

### Text on the board
Reference: + | - | GND | MIDI Synth Project / <ihsan@kehribar.me> / v0.2 - December 2015 | RIGHT | LEFT | 3V3 | RST | DAT | GND | CLK | 3V3 | GND | A10 | A9 | TX | B1 | RX | A0 | GND | A1